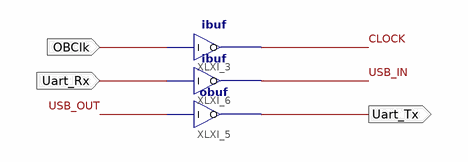
[diagram p0: schematic sheet 1]
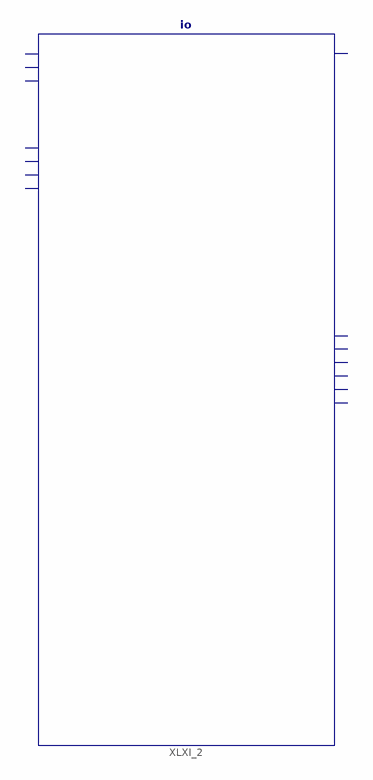
[diagram p1: schematic sheet 2]
// Xilinx ISE schematic general.sch (artix7) as structural Verilog: 4 symbols, 3 ports
module general (
  input  OBClk,
  input  Uart_Rx,
  output Uart_Tx
);

  wire CLOCK, USB_IN, USB_OUT;

  io XLXI_2 ();  // open: clk, reset, uart_tx, uart_rx, uart_interrupt, gpi1, gpi2, gpi3, gpi4, gpo1, gpo2, gpo3, gpo4, intc_irq
  ibuf XLXI_3 (.I(OBClk), .O(CLOCK));
  obuf XLXI_5 (.I(USB_OUT), .O(Uart_Tx));
  ibuf XLXI_6 (.I(Uart_Rx), .O(USB_IN));
endmodule
